# Altium schematic sheet Audio_VU_LED.SchDoc
size A4; Organization: Altium Limited; Address1: L3, 12a Rodborough Rd; Address2: Frenchs Forest; Address3: NSW; Address4: Australia 2086
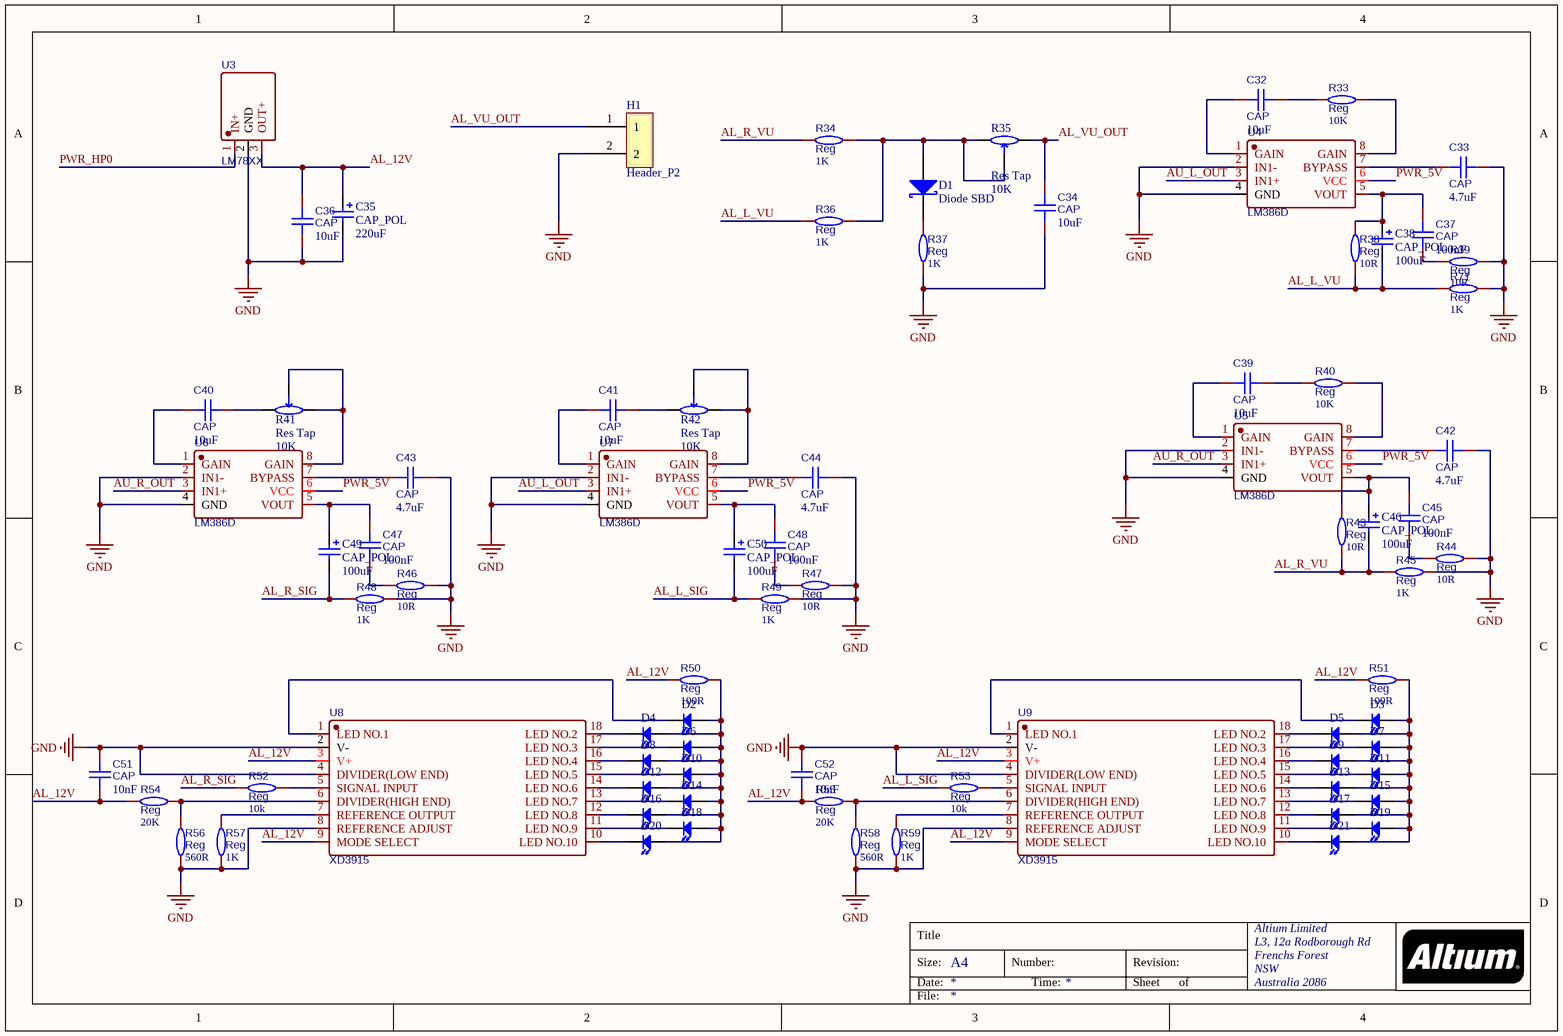
[diagram p0: Audio_VU_LED.SchDoc]

## Parts
C32  CAP  value 10uF  [C0603]
C33  CAP  value 4.7uF  [C0603]
C34  CAP  value 10uF  [C0603]
C35  CAP_POL  value 220uF  [CAP_SMD_6.3mm]
C36  CAP  value 10uF  [C0603]
C37  CAP  value 100nF  [C0603]
C38  CAP_POL  value 100uF  [CAP_SMD_6.3mm]
C39  CAP  value 10uF  [C0603]
C40  CAP  value 10uF  [C0603]
C41  CAP  value 10uF  [C0603]
C42  CAP  value 4.7uF  [C0603]
C43  CAP  value 4.7uF  [C0603]
C44  CAP  value 4.7uF  [C0603]
C45  CAP  value 100nF  [C0603]
C46  CAP_POL  value 100uF  [CAP_SMD_6.3mm]
C47  CAP  value 100nF  [C0603]
C48  CAP  value 100nF  [C0603]
C49  CAP_POL  value 100uF  [CAP_SMD_6.3mm]
C50  CAP_POL  value 100uF  [CAP_SMD_6.3mm]
C51  CAP  value 10nF  [C0603]
C52  CAP  value 10nF  [C0603]
D1  Diode SBD  [SMA_L4.3]
D2  LED  [LED0603_Side]  (value not drawn)
D3  LED  [LED0603_Side]  (value not drawn)
D4  LED  [LED0603_Side]  (value not drawn)
D5  LED  [LED0603_Side]  (value not drawn)
D6  LED  [LED0603_Side]  (value not drawn)
D7  LED  [LED0603_Side]  (value not drawn)
D8  LED  [LED0603_Side]  (value not drawn)
D9  LED  [LED0603_Side]  (value not drawn)
D10  LED  [LED0603_Side]  (value not drawn)
D11  LED  [LED0603_Side]  (value not drawn)
D12  LED  [LED0603_Side]  (value not drawn)
D13  LED  [LED0603_Side]  (value not drawn)
D14  LED  [LED0603_Side]  (value not drawn)
D15  LED  [LED0603_Side]  (value not drawn)
D16  LED  [LED0603_Side]  (value not drawn)
D17  LED  [LED0603_Side]  (value not drawn)
D18  LED  [LED0603_Side]  (value not drawn)
D19  LED  [LED0603_Side]  (value not drawn)
D20  LED  [LED0603_Side]  (value not drawn)
D21  LED  [LED0603_Side]  (value not drawn)
H1  Header_P2  [H_2.54_P2]
R33  Reg  value 10K  [R0603]
R34  Reg  value 1K  [R0603]
R35  Res Tap  value 10K  [RES_TAP_HOR]
R36  Reg  value 1K  [R0603]
R37  Reg  value 1K  [R0603]
R38  Reg  value 10R  [R0603]
R39  Reg  value 10R  [R0603]
R40  Reg  value 10K  [R0603]
R41  Res Tap  value 10K  [RES_TAP_HOR]
R42  Res Tap  value 10K  [RES_TAP_HOR]
R43  Reg  value 10R  [R0603]
R44  Reg  value 10R  [R0603]
R45  Reg  value 1K  [R0603]
R46  Reg  value 10R  [R0603]
R47  Reg  value 10R  [R0603]
R48  Reg  value 1K  [R0603]
R49  Reg  value 1K  [R0603]
R50  Reg  value 100R  [R0603]
R51  Reg  value 100R  [R0603]
R52  Reg  value 10k  [R0603]
R53  Reg  value 10k  [R0603]
R54  Reg  value 20K  [R0603]
R55  Reg  value 20K  [R0603]
R56  Reg  value 560R  [R0603]
R57  Reg  value 1K  [R0603]
R58  Reg  value 560R  [R0603]
R59  Reg  value 1K  [R0603]
R71  Reg  value 1K  [R0603]
U3  LM78XX  [TO-220-3_2.54]
U4  LM386D  [SOP-8]
U5  LM386D  [SOP-8]
U6  LM386D  [SOP-8]
U7  LM386D  [SOP-8]
U8  XD3915  [DIP-18]
U9  XD3915  [DIP-18]

## Nets
GND: C33.2 C34.2 C35.2 C36.2 C42.2 C43.2 C44.2 C51.2 C52.2 H1.2 R37.2 R39.1 R44.1 R45.1 R46.1 R47.1 R48.1 R49.1 R56.2 R57.2 R58.2 R59.2 R71.1 U3.2(GND) U4.2(IN1-) U4.4(GND) U5.2(IN1-) U5.4(GND) U6.2(IN1-) U6.4(GND) U7.2(IN1-) U7.4(GND) U8.2(V-) U8.4(DIVIDER(LOW_END)) U8.8(REFERENCE_ADJUST) U9.2(V-) U9.4(DIVIDER(LOW_END)) U9.8(REFERENCE_ADJUST)
AL_12V: C35.1 C36.1 C51.1 C52.1 R50.1 R51.1 R54.2 R55.2 U3.3(OUT+) U8.3(V+) U8.9(MODE_SELECT) U9.3(V+) U9.9(MODE_SELECT)
AL_L_SIG: C50.2 R49.2 R53.2
AL_L_VU: C38.2 R36.2 R38.2 R71.2
AL_R_SIG: C49.2 R48.2 R52.2
AL_R_VU: C46.2 R34.2 R43.2 R45.2
AL_VU_OUT: C34.1 H1.1 R35.1(A)
AU_L_OUT: U4.3(IN1+) U7.3(IN1+)
AU_R_OUT: U5.3(IN1+) U6.3(IN1+)
PWR_5V: U4.6(VCC) U5.6(VCC) U6.6(VCC) U7.6(VCC)
PWR_HP0: U3.1(IN+)
NetC32_1: C32.1 U4.1(GAIN)
NetC32_2: C32.2 R33.2
NetC33_1: C33.1 U4.7(BYPASS)
NetC37_1: C37.1 R39.2
NetC37_2: C37.2 C38.1 R38.1 U4.5(VOUT)
NetC39_1: C39.1 U5.1(GAIN)
NetC39_2: C39.2 R40.2
NetC40_1: C40.1 U6.1(GAIN)
NetC40_2: C40.2 R41.1(A)
NetC41_1: C41.1 U7.1(GAIN)
NetC41_2: C41.2 R42.1(A)
NetC42_1: C42.1 U5.7(BYPASS)
NetC43_1: C43.1 U6.7(BYPASS)
NetC44_1: C44.1 U7.7(BYPASS)
NetC45_1: C45.1 R44.2
NetC45_2: C45.2 C46.1 R43.1 U5.5(VOUT)
NetC47_1: C47.1 R46.2
NetC47_2: C47.2 C49.1 U6.5(VOUT)
NetC48_1: C48.1 R47.2
NetC48_2: C48.2 C50.1 U7.5(VOUT)
NetD1_1: D1.1(K) R37.1
NetD1_2: D1.2(A) R34.1 R35.2(B) R35.3(TAP) R36.1
NetD2_1: D2.1(K) U8.1(LED_NO.1)
NetD2_2: D2.2(A) D4.2(A) D6.2(A) D8.2(A) D10.2(A) D12.2(A) D14.2(A) D16.2(A) D18.2(A) D20.2(A) R50.2
NetD3_1: D3.1(K) U9.1(LED_NO.1)
NetD3_2: D3.2(A) D5.2(A) D7.2(A) D9.2(A) D11.2(A) D13.2(A) D15.2(A) D17.2(A) D19.2(A) D21.2(A) R51.2
NetD4_1: D4.1(K) U8.18(LED_NO.2)
NetD5_1: D5.1(K) U9.18(LED_NO.2)
NetD6_1: D6.1(K) U8.17(LED_NO.3)
NetD7_1: D7.1(K) U9.17(LED_NO.3)
NetD8_1: D8.1(K) U8.16(LED_NO.4)
NetD9_1: D9.1(K) U9.16(LED_NO.4)
NetD10_1: D10.1(K) U8.15(LED_NO.5)
NetD11_1: D11.1(K) U9.15(LED_NO.5)
NetD12_1: D12.1(K) U8.14(LED_NO.6)
NetD13_1: D13.1(K) U9.14(LED_NO.6)
NetD14_1: D14.1(K) U8.13(LED_NO.7)
NetD15_1: D15.1(K) U9.13(LED_NO.7)
NetD16_1: D16.1(K) U8.12(LED_NO.8)
NetD17_1: D17.1(K) U9.12(LED_NO.8)
NetD18_1: D18.1(K) U8.11(LED_NO.9)
NetD19_1: D19.1(K) U9.11(LED_NO.9)
NetD20_1: D20.1(K) U8.10(LED_NO.10)
NetD21_1: D21.1(K) U9.10(LED_NO.10)
NetR33_1: R33.1 U4.8(GAIN)
NetR40_1: R40.1 U5.8(GAIN)
NetR41_2: R41.2(B) R41.3(TAP) U6.8(GAIN)
NetR42_2: R42.2(B) R42.3(TAP) U7.8(GAIN)
NetR52_1: R52.1 U8.5(SIGNAL_INPUT)
NetR53_1: R53.1 U9.5(SIGNAL_INPUT)
NetR54_1: R54.1 R56.1 U8.6(DIVIDER(HIGH_END))
NetR55_1: R55.1 R58.1 U9.6(DIVIDER(HIGH_END))
NetR57_1: R57.1 U8.7(REFERENCE_OUTPUT)
NetR59_1: R59.1 U9.7(REFERENCE_OUTPUT)

## Notes on the sheet
- Title
- Size:
- Date:
- A4
- Number:
- Time:
- Revision:
- Sheet
- of
- File:

## Library data of the parts
C32-C34 C36 C37 C39-C45 C47 C48 C51 C52 = CAP: BOM_Manufacturer: Huaxin S&T; BOM_Manufacturer Part: 0603B103K101CT; nameAlias: Capacitance; Contributor: LCSC; BOM_Supplier: LCSC; BOM_Supplier Part: C302008; spicePre: C; spiceSymbolName: 0603B103K101CT
C35 C38 C46 C49 C50 = CAP_POL: 极性电容
D1 = Diode SBD: Schottky Rectifier; Note: Terminal 2 is the TAB and is electrically connected to the cathode; Published: 8-Jun-2000; LatestRevisionDate: 17-Jul-2002; LatestRevisionNote: Re-released for DXP Platform.; DatasheetVersion: PD-2.057B; PackageVersion: Feb-1998; PackageReference: TO-220AC; Publisher: Altium Limited; PackageDescription: TO, Thru-Hole, Vertical, Heatsink Mounted; 3 In-Line Leads (1 Absent); Pitch 2.54 mm; ComponentLink1Description: Manufacturer Link; ComponentLink1URL: http://www.irf.com/; ComponentLink2Description: Datasheet; ComponentLink2URL: http://www.irf.com/product-info/datasheets/data/10tq.pdf
D2-D21 = LED0: Published: 8-Jun-2000; LatestRevisionDate: 08-Jul-2005; LatestRevisionNote: Mech Layer 1 removed.; PackageReference: LED-0; Publisher: Altium Limited; PackageDescription: LED; 2 Leads
H1 = Header_P2: 2Pin排针
R33 R34 R36-R40 R43-R59 R71 = Res: 电阻; BOM_Manufacturer: Viking Tech; BOM_Manufacturer Part: AR03BTCX1002A; nameAlias: Resistance (Ohms); Contributor: LCSC; BOM_Supplier: LCSC; BOM_Supplier Part: C465721; spicePre: R; spiceSymbolName: AR03BTCX1002A
R35 R41 R42 = Res Tap: 可调电阻; Sim Note: Enter the Resistance value and the set point into parameter fields.; Set Position: 0.5; Published: 24-Mar-1999; LatestRevisionDate: 17-Jul-2002; LatestRevisionNote: Re-released for DXP Platform.; PackageReference: VR3; Publisher: Altium Limited; PackageDescription: Variable Resistor, Thru-Hole; 3 Leads
U3 = LM78XX: 三端稳压(正电压); BOM_Manufacturer: HGSEMI(华冠); BOM_Manufacturer Part: LM7812T; Contributor: LCSC; BOM_Supplier: LCSC; BOM_Supplier Part: C2902509; BOM_JLCPCB Part Class: Extended Part; spicePre: U; spiceSymbolName: LM7812T
U4-U7 = LM386D: LM386; BOM_Manufacturer: HTC Korea TAEJIN Tech; Contributor: LCSC; BOM_Supplier: LCSC; BOM_Supplier Part: C510560; BOM_Manufacturer Part: LM386D; BOM_JLCPCB Part Class: Extended Part; spicePre: U; spiceSymbolName: LM386D
U8 U9 = LM3915: 电平指示; BOM_Manufacturer: XINLUDA(信路达); Contributor: LCSC; BOM_Supplier: LCSC; BOM_Supplier Part: C609778; BOM_Manufacturer Part: XD3915; BOM_JLCPCB Part Class: Extended Part; Frequency: -; spicePre: U; spiceSymbolName: XD3915